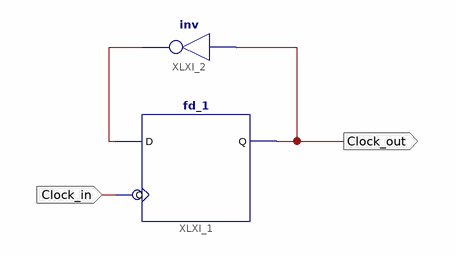
[diagram p0: schematic sheet 1]
// Xilinx ISE schematic TimeClock2.sch (spartan6) as structural Verilog: 2 symbols, 2 ports
module TimeClock2 (
  input  Clock_in,
  output Clock_out
);

  wire XLXN_3;

  fd_1 XLXI_1 (.C(Clock_in), .D(XLXN_3), .Q(Clock_out));
  not XLXI_2 (XLXN_3, Clock_out);
endmodule
